# EAGLE design 16bit-v0_5 (EAGLE 7.3.0)
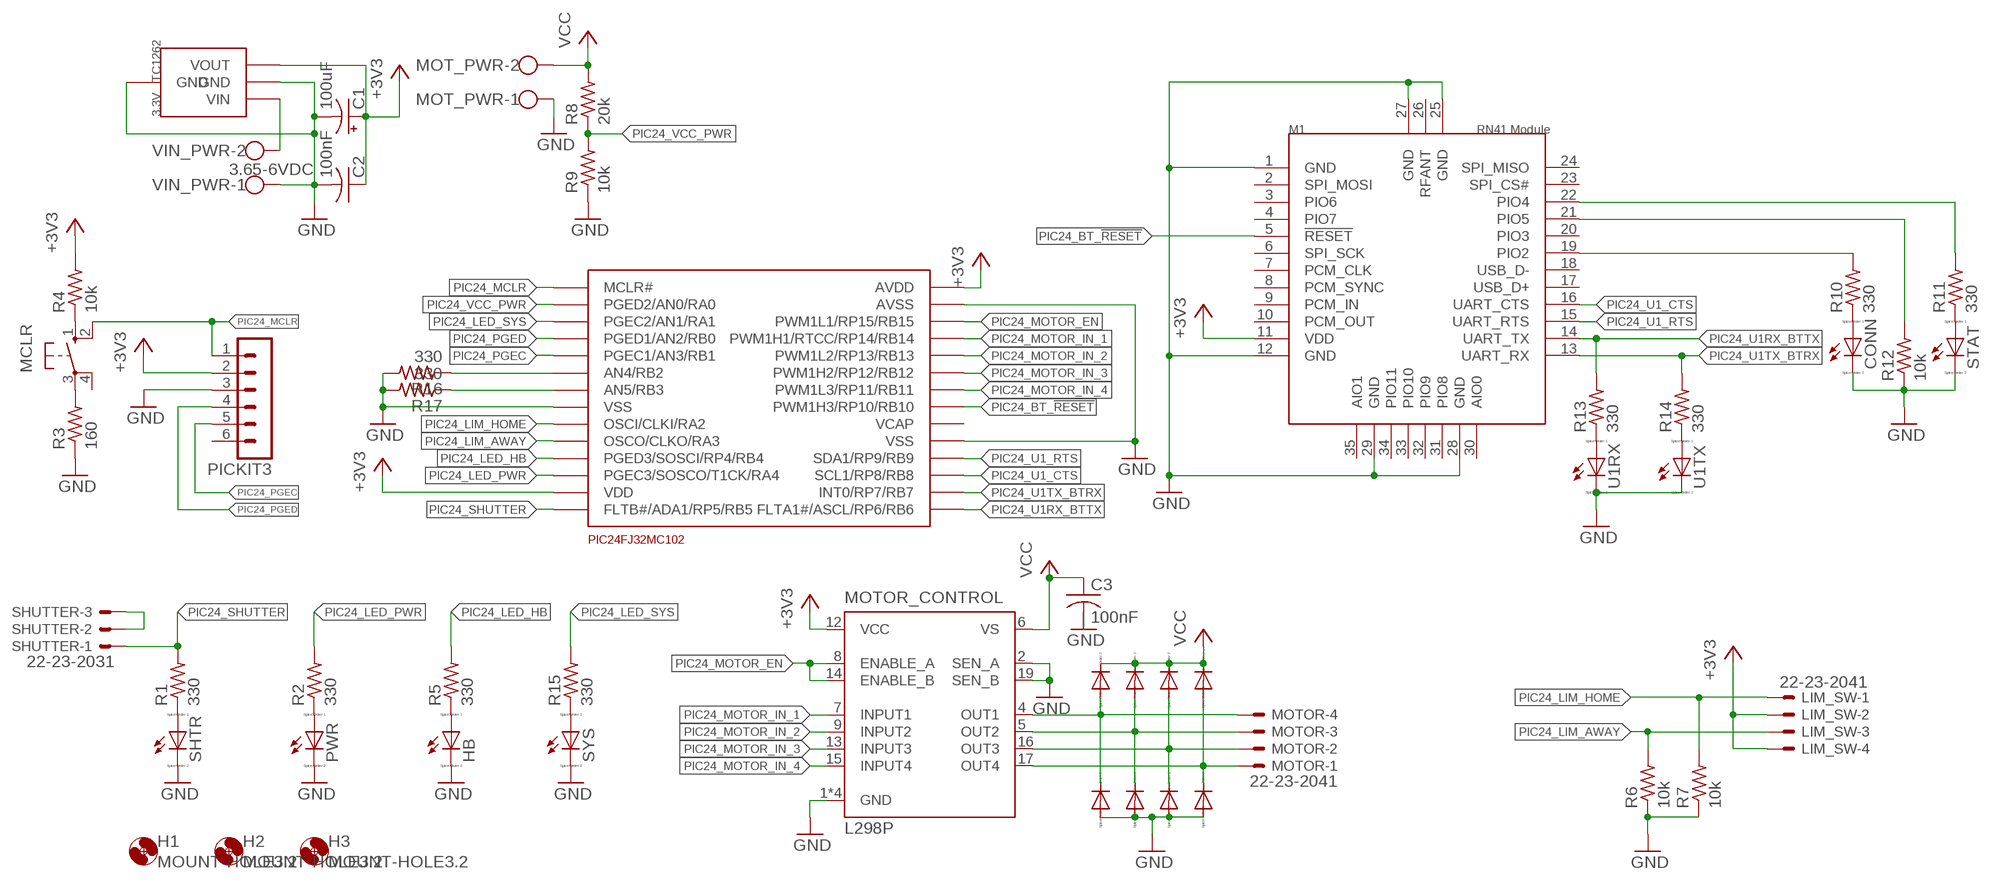
[diagram p0: schematic, sheet 1]

## Parts
C1  100uF  CPOL-USE2.5-7  [E2,5-7]
C2  100nF  C-USC0402  [C0402]
C3  100nF  C-USC0402  [C0402]
CONN  LED_ESML0603  [LED_SML0603]
D1  DIODE-SMB  [SMB]
D2  DIODE-SMB  [SMB]
D3  DIODE-SMB  [SMB]
D4  DIODE-SMB  [SMB]
D5  DIODE-SMB  [SMB]
D6  DIODE-SMB  [SMB]
D7  DIODE-SMB  [SMB]
D8  DIODE-SMB  [SMB]
H1  MOUNT-HOLE3.2  [3,2]
H2  MOUNT-HOLE3.2  [3,2]
H3  MOUNT-HOLE3.2  [3,2]
HB  LED_ESML0603  [LED_SML0603]
LIM_SW  22-23-2041  [22-23-2041]
MCLR  10-XX  [B3F-10XX]
MOT_PWR  W237-102  [W237-102]
MOTOR  22-23-2041  [22-23-2041]
MOTOR_CONTROL  L298P  [POWERSO-20]
PICKIT3  MA06-1  [MA06-1]
PWR  LED_ESML0603  [LED_SML0603]
R1  330  R-US_R0603  [R0603]
R2  330  R-US_R0603  [R0603]
R3  160  R-US_R0603  [R0603]
R4  10k  R-US_R0603  [R0603]
R5  330  R-US_R0603  [R0603]
R6  10k  R-US_R0603  [R0603]
R7  10k  R-US_R0603  [R0603]
R8  20k  R-US_R0603  [R0603]
R9  10k  R-US_R0603  [R0603]
R10  330  R-US_R0603  [R0603]
R11  330  R-US_R0603  [R0603]
R12  10k  R-US_R0603  [R0603]
R13  330  R-US_R0603  [R0603]
R14  330  R-US_R0603  [R0603]
R15  330  R-US_R0603  [R0603]
R16  330  R-US_R0603  [R0603]
R17  330  R-US_R0603  [R0603]
SHTR  LED_ESML0603  [LED_SML0603]
SHUTTER  22-23-2031  [22-23-2031]
STAT  LED_ESML0603  [LED_SML0603]
SYS  LED_ESML0603  [LED_SML0603]
U1RX  LED_ESML0603  [LED_SML0603]
U1TX  LED_ESML0603  [LED_SML0603]
U$1  PIC24FJ32MC102  [PIC2428-SOIC]
U$2  RN41N  [RN41N]
U$3  TC1262-3.3VDBTR  [TO-261-4]
VIN_PWR  3.65-6VDC  W237-102  [W237-102]

## Nets
+3V3: C1.+ C2.1 LIM_SW.2 LIM_SW.4 MOTOR_CONTROL.12(VCC) PICKIT3.2 R4.2 U$1.AVDD U$1.VDD U$2.11(VDD) U$3.P$3(VOUT)
GND: C1.- C2.2 C3.2 CONN.C D5.A D6.A D7.A D8.A HB.C MOT_PWR.1 MOTOR_CONTROL.1(GND) MOTOR_CONTROL.2(SEN_A) MOTOR_CONTROL.10(GND) MOTOR_CONTROL.11(GND) MOTOR_CONTROL.19(SEN_B) MOTOR_CONTROL.20(GND) PICKIT3.3 PWR.C R3.1 R6.1 R7.1 R9.1 R12.1 R16.2 R17.2 SHTR.C STAT.C SYS.C U1RX.C U1TX.C U$1.AVSS U$1.VSS@8(VSS) U$1.VSS@19(VSS) U$2.1(GND) U$2.12(GND) U$2.25(GND) U$2.27(GND) U$2.28(GND) U$2.29(GND) U$3.P$2(GND) U$3.P$4(GND) VIN_PWR.1
MOTOR_OUT_1: D1.A D5.C MOTOR.4 MOTOR_CONTROL.4(OUT1)
MOTOR_OUT_2: D2.A D6.C MOTOR.3 MOTOR_CONTROL.5(OUT2)
MOTOR_OUT_3: D3.A D7.C MOTOR.2 MOTOR_CONTROL.16(OUT3)
MOTOR_OUT_4: D4.A D8.C MOTOR.1 MOTOR_CONTROL.17(OUT4)
N$1: R13.1 U1RX.A
N$2: MCLR.3(P) R3.2
N$3: MCLR.1(S) R4.1
N$4: R1.1 SHTR.A
N$5: R12.2 U$2.21(PIO5)
N$6: PWR.A R2.1
N$7: HB.A R5.1
N$8: R15.1 SYS.A
N$9: R14.1 U1TX.A
N$10: R11.2 U$2.22(PIO4)
N$11: R10.2 U$2.19(PIO2)
N$12: CONN.A R10.1
N$13: R11.1 STAT.A
PIC24_BT_!RESET: U$1.RB10(PWM1H3/RP10/RB10) U$2.5(!RESET)
PIC24_EXTRA_1: R16.1 U$1.RB2(AN4/RB2)
PIC24_EXTRA_2: R17.1 U$1.RB3(AN5/RB3)
PIC24_LED_HB: R5.2 U$1.RB4(PGED3/SOSCI/RP4/RB4)
PIC24_LED_PWR: R2.2 U$1.RA4(PGEC3/SOSCO/T1CK/RA4)
PIC24_LED_SYS: R15.2 U$1.RA1(PGEC2/AN1/RA1)
PIC24_LIM_AWAY: LIM_SW.3 R6.2 U$1.RA3(OSCO/CLKO/RA3)
PIC24_LIM_HOME: LIM_SW.1 R7.2 U$1.RA2(OSCI/CLKI/RA2)
PIC24_MCLR: MCLR.2(S1) PICKIT3.1 U$1.MCLR#
PIC24_MOTOR_EN: MOTOR_CONTROL.8(ENABLE_A) MOTOR_CONTROL.14(ENABLE_B) U$1.RB15(PWM1L1/RP15/RB15)
PIC24_MOTOR_IN_1: MOTOR_CONTROL.7(INPUT1) U$1.RB14(PWM1H1/RTCC/RP14/RB14)
PIC24_MOTOR_IN_2: MOTOR_CONTROL.9(INPUT2) U$1.RB13(PWM1L2/RP13/RB13)
PIC24_MOTOR_IN_3: MOTOR_CONTROL.13(INPUT3) U$1.RB12(PWM1H2/RP12/RB12)
PIC24_MOTOR_IN_4: MOTOR_CONTROL.15(INPUT4) U$1.RB11(PWM1L3/RP11/RB11)
PIC24_PGEC: PICKIT3.5 U$1.PGEC1(PGEC1/AN3/RB1)
PIC24_PGED: PICKIT3.4 U$1.PGED1(PGED1/AN2/RB0)
PIC24_SHUTTER: R1.2 SHUTTER.1 U$1.RB5(FLTB#/ADA1/RP5/RB5)
PIC24_U1_CTS: U$1.RB8(SCL1/RP8/RB8) U$2.16(UART_CTS)
PIC24_U1_RTS: U$1.RB9(SDA1/RP9/RB9) U$2.15(UART_RTS)
PIC24_U1RX_BTTX: R13.2 U$1.RB6(FLTA1#/ASCL/RP6/RB6) U$2.14(UART_TX)
PIC24_U1TX_BTRX: R14.2 U$1.RB7(INT0/RP7/RB7) U$2.13(UART_RX)
PIC24_VCC_PWR: R8.1 R9.2 U$1.RA0(PGED2/AN0/RA0)
SHUTTER_SHORT: SHUTTER.2 SHUTTER.3
VCC: C3.1 D1.C D2.C D3.C D4.C MOT_PWR.2 MOTOR_CONTROL.6(VS) R8.2
VIN_PWR: U$3.P$1(VIN) VIN_PWR.2
Unconnected: MCLR.4(P1) PICKIT3.6 U$1.VCAP U$2.2(SPI_MOSI) U$2.3(PIO6) U$2.4(PIO7) U$2.6(SPI_SCK) U$2.7(PCM_CLK) U$2.8(PCM_SYNC) U$2.9(PCM_IN) U$2.10(PCM_OUT) U$2.17(USB_D+) U$2.18(USB_D-) U$2.20(PIO3) U$2.23(SPI_CS#) U$2.24(SPI_MISO) U$2.26(RFANT) U$2.30(AIO0) U$2.31(PIO8) U$2.32(PIO9) U$2.33(PIO10) U$2.34(PIO11) U$2.35(AIO1)

## Library data of the parts
C1 = rcl:CPOL-US: POLARIZED CAPACITOR, American symbol
C2 C3 = rcl:C-US: CAPACITOR, American symbol
CONN HB PWR SHTR STAT SYS U1RX U1TX = eagle-ltspice:LED_E: LED Source: http://www.osram.convergy.de Source: www.luxeon.com Source: www.kingbright.com; SPICEMODEL: NONE; SPICEPREFIX: D; SPICETYPE: diode
D1-D8 = diode:DIODE-: DIODE
H1-H3 = holes:MOUNT-HOLE: MOUNTING HOLE with drill center marker
LIM_SW MOTOR = con-molex:22-23-2041: .100" (2.54mm) Center Header - 4 Pin; MF: MOLEX; MPN: 22-23-2041; OC_FARNELL: 1462920; OC_NEWARK: 38C0355
MCLR = switch-omron:10-XX: OMRON SWITCH; MPN: B3F-1000; OC_FARNELL: 176432; OC_NEWARK: 36M3542
MOT_PWR VIN_PWR = con-wago-500:W237-102: WAGO SCREW CLAMP; MPN: 237-102; OC_FARNELL: unknown; OC_NEWARK: 70K9898
MOTOR_CONTROL = st-microelectronics:L298: DUAL FULL-BRIDGE DRIVER
PICKIT3 = con-lstb:MA06-1: PIN HEADER; OC_FARNELL: unknown; OC_NEWARK: unknown
R1-R17 = rcl:R-US_: RESISTOR, American symbol
SHUTTER = con-molex:22-23-2031: .100" (2.54mm) Center Header - 3 Pin; MF: MOLEX; MPN: 22-23-2031; OC_FARNELL: 1462950; OC_NEWARK: 30C0862
U$1 = MORDOR:PIC24FJ32MC102
U$2 = MORDOR:RN41N
U$3 = MORDOR:TC1262-3.3VDBTR

## Board
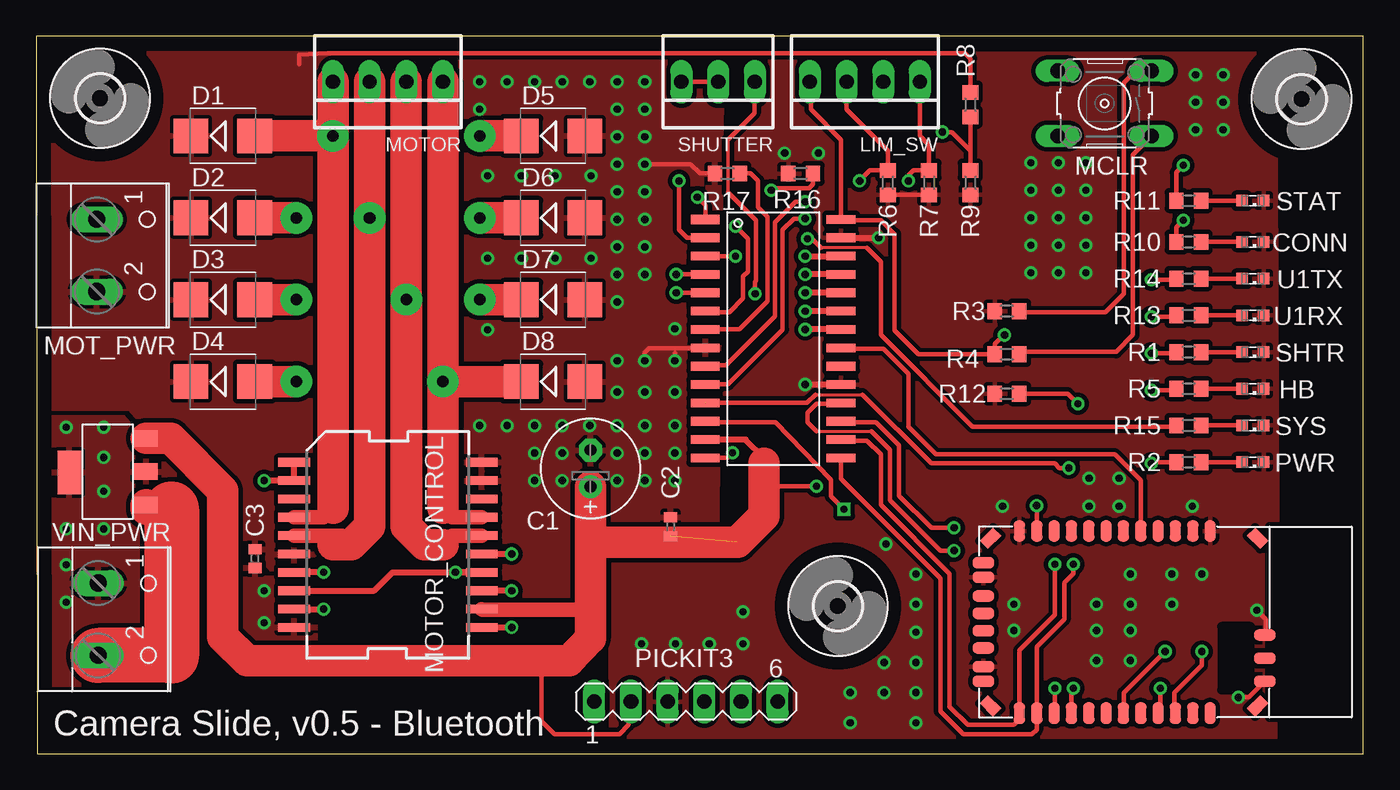
[diagram p1: board, top side]
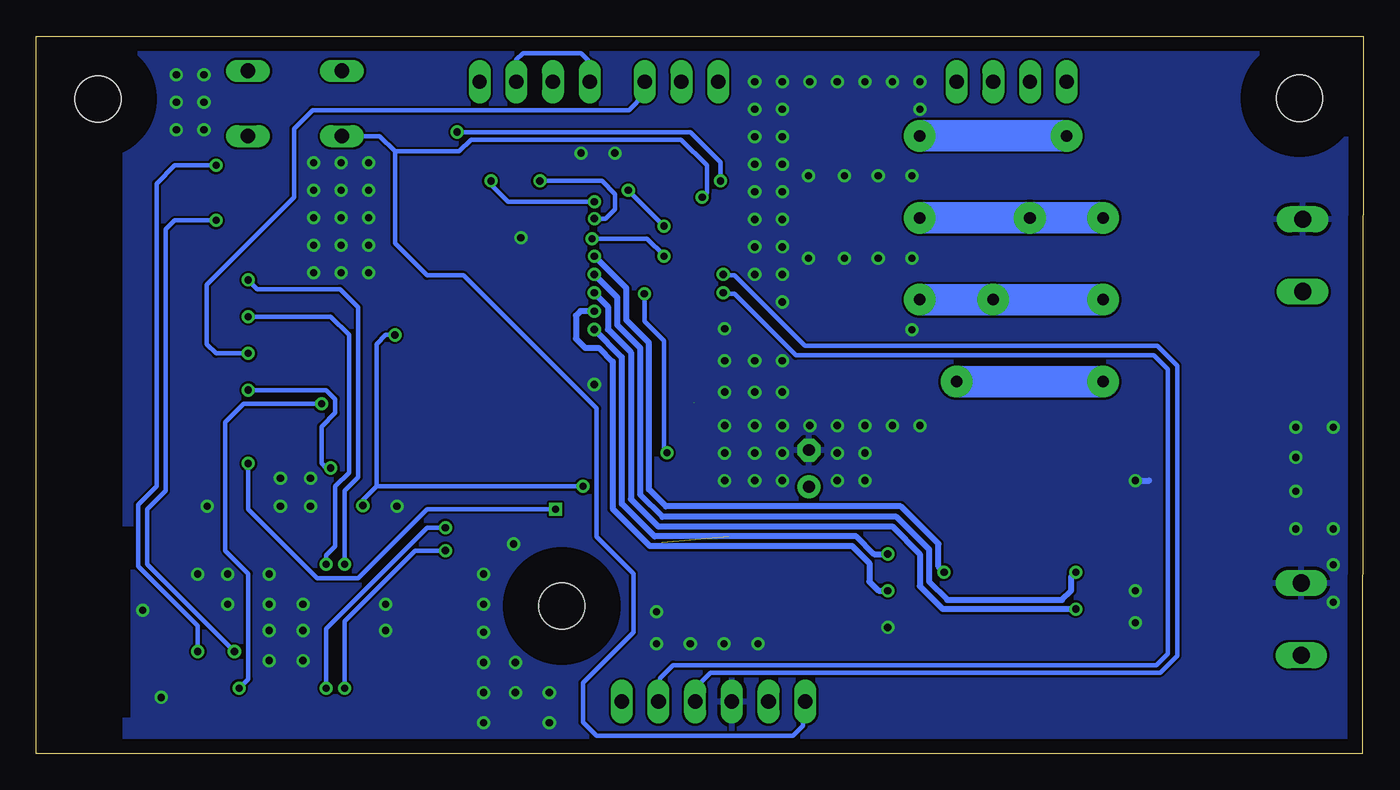
[diagram p2: board, bottom side, seen from below]

Size 91.89 x 49.65 mm. Coordinates in mm from the lower left corner, seen from the top.
Outline: 0,49.65 0.07,0 91.89,0 91.89,49.65 0,49.65
Copper layers (1*16): Top 0.035mm / dielectric 1.5mm / Bottom 0.035mm
Design rules "ITEAED *": minimum track width 8mil, minimum drill 0.3mm, track to track 6mil, track to pad 6mil, pad to pad 6mil, via to via 6mil, smd to smd 6mil, copper to edge 40mil, drill to drill 8mil, minimum pad ring 10mil, minimum via ring 8mil, stop-mask expansion 4mil, vias tented up to drill 0mil, thermal gap 10mil

### Footprints (pad centres in the part's own frame; a part is rotated, then mirrored left to right if it is on the bottom)
E2,5-7 = drill 0.813 pad 1.6: + -1.27,0 | drill 0.813 pad 1.6 octagon: - 1.27,0
C0402 = smd 0.7 x 0.9: 1 -0.65,0; 2 0.65,0
LED_SML0603 = smd 0.8 x 0.8: A 0.75,0; C -0.75,0
SMB = smd 2.4 x 2.4: A 2.2,0; C -2.2,0
3,2 = hole 3.2: 0,0
22-23-2041 = drill 1 long: 1 -3.81,0; 2 -1.27,0; 3 1.27,0; 4 3.81,0
B3F-10XX = drill 1.016 long: 1 -3.251,2.261; 2 3.251,2.261; 3 -3.251,-2.261; 4 3.251,-2.261
W237-102 = drill 1.194 long: 1 -2.5,-1.27; 2 2.5,-1.27
POWERSO-20 = smd 0.6 x 2.2: 1 -5.715,-6.5; 2 -4.445,-6.5; 3 -3.175,-6.5; 4 -1.905,-6.5; 5 -0.635,-6.5; 6 0.635,-6.5; 7 1.905,-6.5; 8 3.175,-6.5; 9 4.445,-6.5; 10 5.715,-6.5; 11 5.715,6.5; 12 4.445,6.5; 13 3.175,6.5; 14 1.905,6.5; 15 0.635,6.5; 16 -0.635,6.5; 17 -1.905,6.5; 18 -3.175,6.5; 19 -4.445,6.5; 20 -5.715,6.5
MA06-1 = drill 1.016 long: 1 -6.35,0; 2 -3.81,0; 3 -1.27,0; 4 1.27,0; 5 3.81,0; 6 6.35,0
R0603 = smd 1 x 1.1: 1 -0.85,0; 2 0.85,0
22-23-2031 = drill 1 long: 1 -2.54,0; 2 0,0; 3 2.54,0
PIC2428-SOIC = smd 2 x 0.6: AVDD 4.699,8.255; AVSS 4.699,6.985; MCLR# -4.699,8.255; PGEC1 -4.699,3.175; PGED1 -4.699,4.445; RA0 -4.699,6.985; RA1 -4.699,5.715; RA2 -4.699,-1.905; RA3 -4.699,-3.175; RA4 -4.699,-5.715; RB2 -4.699,1.905; RB3 -4.699,0.635; RB4 -4.699,-4.445; RB5 -4.699,-8.255; RB6 4.699,-8.255; RB7 4.699,-6.985; RB8 4.699,-5.715; RB9 4.699,-4.445; RB10 4.699,-0.635; RB11 4.699,0.635; RB12 4.699,1.905; RB13 4.699,3.175; RB14 4.699,4.445; RB15 4.699,5.715; VCAP 4.699,-1.905; VDD -4.699,-6.985; VSS@8 -4.699,-0.635; VSS@19 4.699,-3.175
RN41N = smd 1.5 x 0.8: 1 -6.3,6; 2 -6.3,4.8; 3 -6.3,3.6; 4 -6.3,2.4; 5 -6.3,1.2; 6 -6.3,0; 7 -6.3,-1.2; 8 -6.3,-2.4; 9 -6.3,-3.6; 10 -6.3,-4.8; 11 -6.3,-6; 12 -6.3,-7.2; 13 6.3,-7.2; 14 6.3,-6; 15 6.3,-4.8; 16 6.3,-3.6; 17 6.3,-2.4; 18 6.3,-1.2; 19 6.3,0; 20 6.3,1.2; 21 6.3,2.4; 22 6.3,3.6; 23 6.3,4.8; 24 6.3,6 | smd 0.8 x 1.5: 25 4.1,9.8; 26 2.5,9.8; 27 0.9,9.8; 28 3.1,-9.7; 29 -3.1,-9.7; 30 4.1,-9.7; 31 1.8,-9.7; 32 0.6,-9.7; 33 -0.6,-9.7; 34 -1.8,-9.7; 35 -4.1,-9.7 | smd 1.3 x 0.8 rotated 225: SHIELD@1 -5.8,9.3; SHIELD@3 5.8,-9.2 | smd 1.3 x 0.8 rotated 135: SHIELD@2 -5.8,-9.2; SHIELD@4 5.8,9.3
TO-261-4 = smd 1.14 x 1.65: P$1 -2.25,-3.05; P$2 0.05,-3.05; P$3 2.35,-3.05 | smd 3 x 1.65: P$4 0,2.25

### Placement (x,y rotation side)
C1  38.39,19.73 90 top
C2  43.93,15.69 90 top
C3  15.15,13.49 270 top
CONN  84.24,35.4 180 top
D1  12.93,42.75 0 top
D2  12.93,37.08 0 top
D3  12.93,31.41 0 top
D4  12.93,25.74 0 top
D5  35.79,42.75 0 top
D6  35.79,37.08 0 top
D7  35.79,31.41 0 top
D8  35.79,25.74 0 top
H1  4.43,45.35 270 top
H2  87.61,45.29 270 top
H3  55.51,10.2 270 top
HB  84.24,25.24 180 top
LIM_SW  57.38,46.49 180 top
MCLR  73.97,44.99 180 top
MOT_PWR  5.47,34.47 270 top
MOTOR  24.36,46.49 180 top
MOTOR_CONTROL  24.36,14.44 270 top
PICKIT3  44.99,3.6 0 top
PWR  84.24,20.16 180 top
R1  79.79,27.78 180 top
R2  79.79,20.16 180 top
R3  67.22,30.62 0 top
R4  67.22,27.63 180 top
R5  79.79,25.24 180 top
R6  58.97,39.51 90 top
R7  61.82,39.51 90 top
R8  64.68,44.9 90 top
R9  64.68,39.51 90 top
R10  79.79,35.4 180 top
R11  79.79,38.26 180 top
R12  67.22,24.9 0 top
R13  79.79,30.32 180 top
R14  79.79,32.86 180 top
R15  79.79,22.7 180 top
R16  52.93,40.14 180 top
R17  47.85,40.14 180 top
SHTR  84.24,27.78 180 top
SHUTTER  47.22,46.49 180 top
STAT  84.24,38.26 180 top
SYS  84.24,22.7 180 top
U1RX  84.24,30.32 180 top
U1TX  84.24,32.86 180 top
U$1  51.03,28.71 0 top
U$2  75.28,9.1 270 top
U$3  4.56,19.46 90 top
VIN_PWR  5.57,9.3 270 top

### Tracks (layer width: path | path; a pad name or v marks a point on that pad's centre or on a via)
+3V3  (via drill 0.5 pad 0.41)  (1 unrouted)
  Top 0.305: LIM_SW.4 53.63,46.43 53.63,44.57 55.73,42.48 U$1.AVDD 55.79,36.9 58.48,36.9 59.43,35.95 59.43,29.28 61.08,27.63 R4.2 66.37,28.37 v67.05,28.97 | 38.71,8.09 38.39,7.96 | PICKIT3.2 41.02,3.43 41.02,1.98 40.38,1.34 35.88,1.34 34.98,2.24 34.98,6.42 | U$2.11 v69.27,17.16 | v54.03,18.49 50.38,18.49
  Top 0.406: U$1.VDD 49.12,21.73 50.38,20.47 50.38,20.1 50.38,18.49 50.38,18.02
  Top 1.016: MOTOR_CONTROL.12 30.91,9.95 38.39,9.95
  Top 2.184: 38.39,14.63 38.39,9.95 38.39,7.96 36.89,6.42 34.98,6.42 14.6,6.42 12.93,8.09 12.93,18.19 9.31,21.81 U$3.P$3 | 38.39,14.63 C1.+ 38.4,12.68 | 38.39,14.63 48.56,14.63 50.38,16.45 50.38,20.1
  Bottom 0.305: v69.27,17.16 69.27,17.54 68.32,18.49 | 68.32,18.49 v54.03,18.49 | 68.32,18.49 68.32,28.33 67.69,28.97 v67.05,28.97 | LIM_SW.4 53.63,46.56 53.63,47.96 54.15,48.48 58.19,48.48 58.65,48.02 LIM_SW.2
GND  (via drill 0.5 pad 0.41)
  Top 0.305: PWR.C 84.87,20.05 | R12.1 66.29,24.98 | R3.1 66.29,30.54 | R16.2 | R9.1 64.7,38.64 | R6.1 R7.1 | R17.2 45.95,40.15 45.32,40.78 v42.14,40.78 | U$2.25 83.96,3.88 v83.24,3.88 | U$2.27 85.15,8.27 85.15,9.28 v84.51,9.92 | U$2.12 68,15.48 | U$1.VSS@8 46.3,28.04 42.44,28.04 42.14,27.74 v42.14,27.18 | 44.22,27.74 v44.22,27.18
  Top 0.406: U$1.AVSS v58.33,35.7 | U$1.VSS@19 v53.25,25.54 | MOTOR_CONTROL.1 MOTOR_CONTROL.2 v15.79,18.89 | MOTOR_CONTROL.11 v32.93,8.73
  Bottom 0.406: v15.79,18.89 14.83,18.89
  other vias: 42.14,46.49 42.14,44.59 42.14,42.68 40.23,46.49 40.23,44.59 40.23,42.68 40.23,40.78 38.33,46.49 36.42,46.49 34.52,46.49 32.61,46.49 30.71,46.49 30.71,44.59 42.14,35.06 42.14,33.16 40.23,35.06 40.23,33.16 40.23,31.25 42.14,38.87 42.14,36.97 42.14,25.02 40.23,36.97 40.23,27.18 40.23,25.02 42.14,22.7 40.23,22.7 40.23,20.79 42.14,20.79 42.14,18.89 40.23,18.89 38.33,22.7 36.42,22.7 36.42,20.79 36.42,18.89 34.52,22.7 34.52,20.79 32.61,22.7 30.71,22.7 34.52,18.89 15.79,9.05 15.79,11.27 4.69,22.57 2.08,22.57 4.69,20.49 4.69,18.15 4.69,15.54 2.08,15.54 2.08,13.07 2.08,10.47 40.23,38.87 67.69,10.34 67.69,8.52 73.42,10.34 73.42,8.52 73.42,6.43 75.76,6.43 75.76,8.52 75.76,10.34 75.76,12.42 78.63,12.42 80.71,12.42 78.63,10.34 44.26,7.6 41.92,7.6 46.6,7.6 48.95,9.82 48.95,7.6 56.37,4.22 58.71,6.3 58.71,4.22 56.37,2.14 60.92,2.14 60.92,4.22 60.92,6.3 60.92,8.39 60.92,10.34 60.92,12.42 58.84,14.5 72.9,17.11 74.98,17.11 80.06,17.11 66.91,17.11 68.87,40.89 68.87,38.99 70.77,38.99 70.77,40.89 72.68,40.89 72.68,38.99 68.87,37.08 70.77,37.08 68.87,35.18 70.77,35.18 72.68,35.18 72.68,37.08 68.87,33.27 70.77,33.27 72.68,33.27 80.28,46.97 80.28,45.07 82.18,45.07 82.18,46.97 80.28,43.16 82.18,43.16 31.25,40 31.25,29.32 33.59,40 35.94,40 38.41,40 31.25,34.27 33.59,34.27 35.94,34.27 38.41,34.27 72.9,19.06 74.98,19.06 51.82,41.55 54.17,41.55 44.22,25.02 44.22,22.7 44.22,20.79 44.22,18.89 44.22,29.39
  pour Bottom (rank 6): 0,49.9 85.72,49.9 85.72,-0.58 0,-0.35
  pour Top (isolate 0.305, rank 6): 0,24.02 5.91,24.15 16.1,12.86 19.28,12.86 19.28,4.58 0,4.81
  pour Top (isolate 0.305): 29.44,49.03 47.44,49.03 47.05,10.44 29.05,10.44
  pour Top (isolate 0.305, rank 6): 39.7,13.59 44.91,13.59 46.99,15.94 47.51,17.89 47.51,48.48 85.79,48.74 85.92,15.81 85.79,0.05 39.83,0.05
MOTOR_OUT_1  (via drill 0.8 pad 2.18)
  Top 0.61: 20.55,16.98 19.91,16.35
  Top 1.016: 19.91,16.35 MOTOR_CONTROL.4
  Top 2.184: MOTOR.4 v20.55,42.75 | v20.55,42.75 20.55,16.98 | v30.71,42.75 D5.C | D1.A v20.55,42.75
  Bottom 2.184: v20.55,42.75 v30.71,42.75
MOTOR_OUT_2  (via drill 0.8 pad 2.18)
  Top 0.61: 20.55,14.44 21.18,15.08
  Top 1.016: 21.18,15.08 MOTOR_CONTROL.5
  Top 2.184: 20.55,14.44 21.82,14.44 23.09,15.71 v23.09,37.08 MOTOR.3 | D6.C v30.71,37.08 | v18.01,37.08 D2.A
  Bottom 2.184: v30.71,37.08 v23.09,37.08 v18.01,37.08
MOTOR_OUT_3  (via drill 0.8 pad 2.18)
  Top 1.016: 28.17,14.44 28.8,15.08 MOTOR_CONTROL.16
  Top 2.184: MOTOR.2 v25.63,31.41 | v25.63,31.41 25.63,15.71 25.66,15.69 | 25.66,15.69 26.9,14.44 28.17,14.44 | D7.C v30.71,31.41 | v18.01,31.41 D3.A | v25.63,31.41 25.66,31.38 25.66,15.69
  Bottom 2.184: v18.01,31.41 v25.63,31.41 v30.71,31.41
MOTOR_OUT_4  (via drill 0.8 pad 2.18)
  Top 1.016: 28.17,16.98 28.8,16.35 MOTOR_CONTROL.17
  Top 2.184: MOTOR.1 v28.17,25.74 | v18.01,25.74 D4.A | v28.17,25.74 28.17,16.98 | v28.17,25.74 D8.C
  Bottom 2.184: v28.17,25.74 v18.01,25.74
N$1
  Top 0.305: R13.1 U1RX.A
N$2
  Top 0.305: R3.2 68.14,30.55 74.03,30.55 75.31,31.82 75.31,46.43 76.13,47.25 MCLR.3
N$3
  Top 0.305: R4.1 68.11,27.8 74.77,27.8 75.94,28.97 75.94,41.45 MCLR.1
N$4
  Top 0.305: R1.1 SHTR.A
N$5  (via drill 0.5 pad 0.41)
  Top 0.305: U$2.21 77.84,2.97 v77.84,4.52 | v72.13,24.2 71.43,24.9 R12.2
  Bottom 0.305: v77.84,4.52 77.21,5.15 77.21,12.46 78.8,14.04 78.8,22.93 77.53,24.2 v72.13,24.2
N$6
  Top 0.305: R2.1 PWR.A
N$7
  Top 0.305: R5.1 HB.A
N$8
  Top 0.305: R15.1 SYS.A
N$9
  Top 0.305: R14.1 U1TX.A
N$10  (via drill 0.5 pad 0.41)
  Top 0.305: U$2.22 78.8,2.88 78.8,4.2 80.7,6.11 v80.7,7.06 | v79.43,40.71 78.94,40.22 R11.2
  Bottom 0.305: v80.7,7.06 80.7,8.83 84.83,12.96 84.83,17.22 83.56,18.49 83.56,39.44 82.29,40.71 v79.43,40.71
N$11  (via drill 0.5 pad 0.41)
  Top 0.305: U$2.19 75.31,2.83 75.31,4.2 v78.16,7.06 | v79.43,36.9 78.94,36.41 R10.2
  Bottom 0.305: v78.16,7.06 84.19,13.09 84.19,16.9 82.92,18.17 82.92,36.27 82.29,36.9 v79.43,36.9
N$12
  Top 0.305: R10.1 CONN.A
N$13
  Top 0.305: R11.1 STAT.A
PIC24_BT_!RESET
  Top 0.305: U$1.RB10 55.79,28.01 58.66,28.01 60.38,26.3 60.38,22.62 62.29,20.71 74.67,20.71 76.48,18.9 U$2.5
PIC24_EXTRA_1  (via drill 0.5 pad 0.41)
  Top 0.305: U$1.RB2 46.27,30.55 | v50.9,38.98 51.03,39.11 53.5,39.11 53.78,39.39 R16.1 | 46.23,30.52 46.27,30.55 | 46.27,30.55 48,30.55 48.95,31.51 48.95,33.04 49.27,33.35 49.27,35.63 48.42,36.48 v48.42,36.5
  Bottom 0.305: v48.42,36.5 v50.9,38.98
PIC24_EXTRA_2
  Top 0.305: R17.1 49.47,40.15 49.99,39.63 49.99,37.81 50.64,37.15 50.64,31.3 48.69,29.35 U$1.RB3
PIC24_LED_HB  (via drill 0.5 pad 0.41)  (1 unrouted)
  Top 0.203: 53.94,24.84 57.21,24.84
  Top 0.305: 53.94,24.84 53.37,24.27 46.34,24.27 | 57.21,24.84 61.97,20.08 70.54,20.08 70.86,19.76 v71.5,19.76 | R5.2 78.85,25.16 v77.21,25.16
  Bottom 0.305: v71.5,19.76 71.81,19.76 72.13,20.08 72.13,22.62 71.18,23.57 71.18,24.52 71.81,25.16 v77.21,25.16
PIC24_LED_PWR  (via drill 0.5 pad 0.41)
  Top 0.305: U$1.RA4 46.39,22.93 51.17,22.93 55.04,18.94 55.04,17.8 v55.94,16.9 | v77.21,20.08 77.3,20.16 R2.2
  Bottom 0.305: v55.94,16.9 64.83,16.9 69.59,12.14 72.45,12.14 77.21,16.9 v77.21,20.08
PIC24_LED_SYS  (via drill 0.5 pad 0.41)
  Top 0.203: 57.52,35 54.35,35
  Top 0.305: R15.2 78.85,22.62 64.83,22.62 58.48,28.97 58.48,34.05 57.52,35 | 54.35,35 53.72,35.63 v53.4,35.63 | v48.42,34.42 48.42,34.43 U$1.RA1
  Bottom 0.305: v53.4,35.63 49.59,35.63 48.42,34.47 v48.42,34.42
PIC24_LIM_AWAY  (via drill 0.5 pad 0.41)
  Top 0.305: LIM_SW.3 56.1,44.57 58.97,41.71 R6.2 57.75,40.36 v57.02,39.63 | U$1.RA3 46.36,25.57 47.9,25.57 51.68,29.34 51.68,36.24 52.46,37.02 v53.24,37.02
  Bottom 0.305: v53.24,37.02 52.46,37.02 51.81,37.68 51.81,38.72 52.72,39.63 v57.02,39.63
PIC24_LIM_HOME  (via drill 0.5 pad 0.41)
  Top 0.305: LIM_SW.1 61.18,42.75 61.82,42.11 R7.2 | R7.2 61.88,40.41 | U$1.RA2 46.39,26.87 47.77,26.87 51.16,30.26 51.16,36.76 52.59,38.2 v53.24,38.2 | v60.4,39.63 60.4,40.02 60.74,40.36 R7.2
  Bottom 0.305: v53.24,38.2 59.23,38.2 60.4,39.37 v60.4,39.63
PIC24_MCLR  (via drill 0.5 pad 0.41)
  Top 0.305: v45.78,38.49 46.33,37.94 U$1.MCLR#
  Bottom 0.305: MCLR.2 68.12,42.73 67.05,41.67 | 67.05,41.67 62.6,41.67 61.78,42.49 47.23,42.49 45.46,40.71 45.46,38.81 v45.78,38.49 | PICKIT3.1 38.79,3.45 38.79,1.92 39.48,1.23 53.08,1.23 54.03,2.18 54.03,4.89 50.54,8.39 50.54,12.46 53.08,15 53.08,23.89 62.29,33.09 64.83,33.09 67.05,35.32 67.05,41.67
PIC24_MOTOR_EN  (via drill 0.5 pad 0.41)
  Top 0.406: MOTOR_CONTROL.8 23.41,11.27 24.68,12.54 MOTOR_CONTROL.14 30.85,12.55 v29.03,12.55 | v53.24,34.42 53.38,34.43 U$1.RB15
  Bottom 0.406: v29.03,12.55 29.42,12.94 29.42,14.5 32.02,17.11 48.3,17.11 49.47,18.28 49.47,28.43 51.03,29.99 51.03,32.21 v53.24,34.42
PIC24_MOTOR_IN_1  (via drill 0.5 pad 0.41)
  Top 0.406: U$1.RB14 v53.25,33.16 | v19.91,12.54 MOTOR_CONTROL.7
  Bottom 0.406: v53.25,33.16 51.66,31.57 51.66,29.66 50.08,28.08 50.08,17.92 48.54,16.38 32.33,16.38 30.07,14.13 30.07,11.9 28.8,10.63 20.87,10.63 20.23,11.27 20.23,12.22 v19.91,12.54
PIC24_MOTOR_IN_2  (via drill 0.5 pad 0.41)
  Top 0.406: U$1.RB13 v53.25,31.89 | MOTOR_CONTROL.9 v19.91,10
  Bottom 0.406: v53.25,31.89 52.3,30.93 52.3,29.35 50.71,27.76 50.71,17.6 48.83,15.71 32.61,15.71 30.71,13.81 30.71,11.59 29.12,10 v19.91,10
PIC24_MOTOR_IN_3  (via drill 0.5 pad 0.41)
  Top 0.406: U$1.RB12 v53.25,30.62 | v32.93,11.27 MOTOR_CONTROL.13
  Bottom 0.406: v53.25,30.62 54.2,30.62 54.52,30.3 54.52,28.71 53.89,28.08 52.93,28.08 51.98,27.12 51.98,16.94 49.4,14.36 35.39,14.36 34.2,13.17 34.2,11.9 33.57,11.27 v32.93,11.27
PIC24_MOTOR_IN_4  (via drill 0.5 pad 0.41)
  Top 0.406: U$1.RB11 v53.25,29.35 | v32.93,13.81 MOTOR_CONTROL.15
  Bottom 0.406: v53.25,29.35 51.35,27.44 51.35,17.28 51.33,17.28 49.08,15.02 35.1,15.02 33.88,13.81 v32.93,13.81
PIC24_PGEC  (via drill 0.5 pad 0.41)
  Top 0.305: v44.32,31.89 U$1.PGEC1
  Bottom 0.305: PICKIT3.5 48.71,3.69 48.71,5.2 47.79,6.13 14.32,6.13 13.54,6.91 13.54,26.58 14.52,27.56 39.29,27.56 43.55,31.82 44.26,31.82 v44.32,31.89
PIC24_PGED  (via drill 0.5 pad 0.41)
  Top 0.305: v44.32,33.16 U$1.PGED1
  Bottom 0.305: PICKIT3.4 46.24,3.62 46.24,4.56 45.2,5.6 14.06,5.6 12.89,6.78 12.89,26.84 14.26,28.21 38.67,28.21 43.55,33.09 44.23,33.09 44.32,33.19 v44.32,33.16
PIC24_SHUTTER  (via drill 0.5 pad 0.41)
  Top 0.254: 47.9,42.49 47.9,38.85
  Top 0.305: SHUTTER.1 49.73,46.46 49.73,44.31 47.9,42.49 | 47.9,38.85 49.86,36.89 49.86,32.73 49.78,32.66 v49.78,31.82 | v48.22,20.81 47.87,20.46 U$1.RB5 | R1.2 78.85,27.7 v77.21,27.7
  Bottom 0.305: v49.78,31.82 49.78,29.92 48.42,28.56 48.42,21.01 v48.22,20.81 | v77.21,27.7 79.43,27.7 80.07,28.33 80.07,32.46 74.03,38.49 74.03,43.25 72.77,44.52 50.86,44.52 49.76,45.62 SHUTTER.1
PIC24_U1_CTS  (via drill 0.5 pad 0.41)
  Top 0.305: U$1.RB8 55.79,22.93 58.16,22.93 59.75,21.35 59.75,17.85 61.97,15.63 v63.56,15.63 | v71.81,4.52 71.68,4.39 U$2.16
  Bottom 0.305: v63.56,15.63 64.83,15.63 71.81,8.65 v71.81,4.52
PIC24_U1_RTS  (via drill 0.5 pad 0.41)
  Top 0.203: 54.03,22.3 57.84,22.3
  Top 0.305: U$1.RB9 55.66,24.2 54.03,24.2 53.4,23.57 53.4,22.93 54.03,22.3 | 57.84,22.3 59.11,21.03 59.11,17.54 62.6,14.04 v63.56,14.04 | U$2.15 70.54,2.86 v70.54,4.52
  Bottom 0.305: v70.54,4.52 70.54,9.15 65.65,14.04 v63.56,14.04
PIC24_U1RX_BTTX  (via drill 0.5 pad 0.41)
  Top 0.305: U$1.RB6 55.73,19.02 62.6,12.14 62.6,2.93 64.19,1.34 68.95,1.34 69.27,1.66 69.27,2.79 U$2.14 69.28,7.38 71.18,9.28 71.18,11.82 71.81,12.46 v71.81,13.09 | R13.2 78.85,30.24 v77.21,30.24
  Bottom 0.305: v77.21,30.24 71.5,30.24 70.22,28.97 70.22,19.44 71.18,18.49 71.18,14.36 71.81,13.73 v71.81,13.09
PIC24_U1TX_BTRX  (via drill 0.5 pad 0.41)
  Top 0.305: U$2.13 68,2.56 | U$1.RB7 55.79,21.66 57.52,21.66 58.48,20.71 58.48,17.22 63.24,12.46 63.24,3.25 64.51,1.98 67.69,1.98 68.08,2.37 U$2.13 | R14.2 78.85,32.78 v77.21,32.78 | v70.54,13.09 70.54,9.6 68.08,7.14 U$2.13
  Bottom 0.305: v77.21,32.78 76.58,32.14 70.86,32.14 69.59,30.87 69.59,19.12 70.54,18.17 v70.54,13.09
PIC24_VCC_PWR  (via drill 0.5 pad 0.41)
  Top 0.305: R8.1 R9.2 64.73,40.41 64.7,40.44 64.7,41.71 63.4,43.01 v62.74,43.01 | v44.52,39.63 44.52,36.24 45.07,35.7 U$1.RA0
  Bottom 0.305: v62.74,43.01 46.6,43.01 44.52,40.93 v44.52,39.63
SHUTTER_SHORT
  Top 0.305: SHUTTER.3 SHUTTER.2
VCC
  Top 0.305: R8.2 64.7,45.77 64.7,48.09 64.31,48.48 20.18,48.48 18.22,48.35 18.22,47.7
  pour Top (isolate 0.305, rank 5): 0,49.26 20.32,49.26 19.28,12.86 16.49,12.6 6.51,23.89 0,23.86
VIN_PWR
  Top 2.184: U$3.P$1 7.64,16.92 9.38,16.92
  Top 3.81: 9.38,16.92 9.38,6.76 9.34,6.8 VIN_PWR.2

### Text on the board
tPlace: Camera Slide, v0.5 - Bluetooth